# EAGLE design lm2765gizmo (EAGLE 6.6.0)
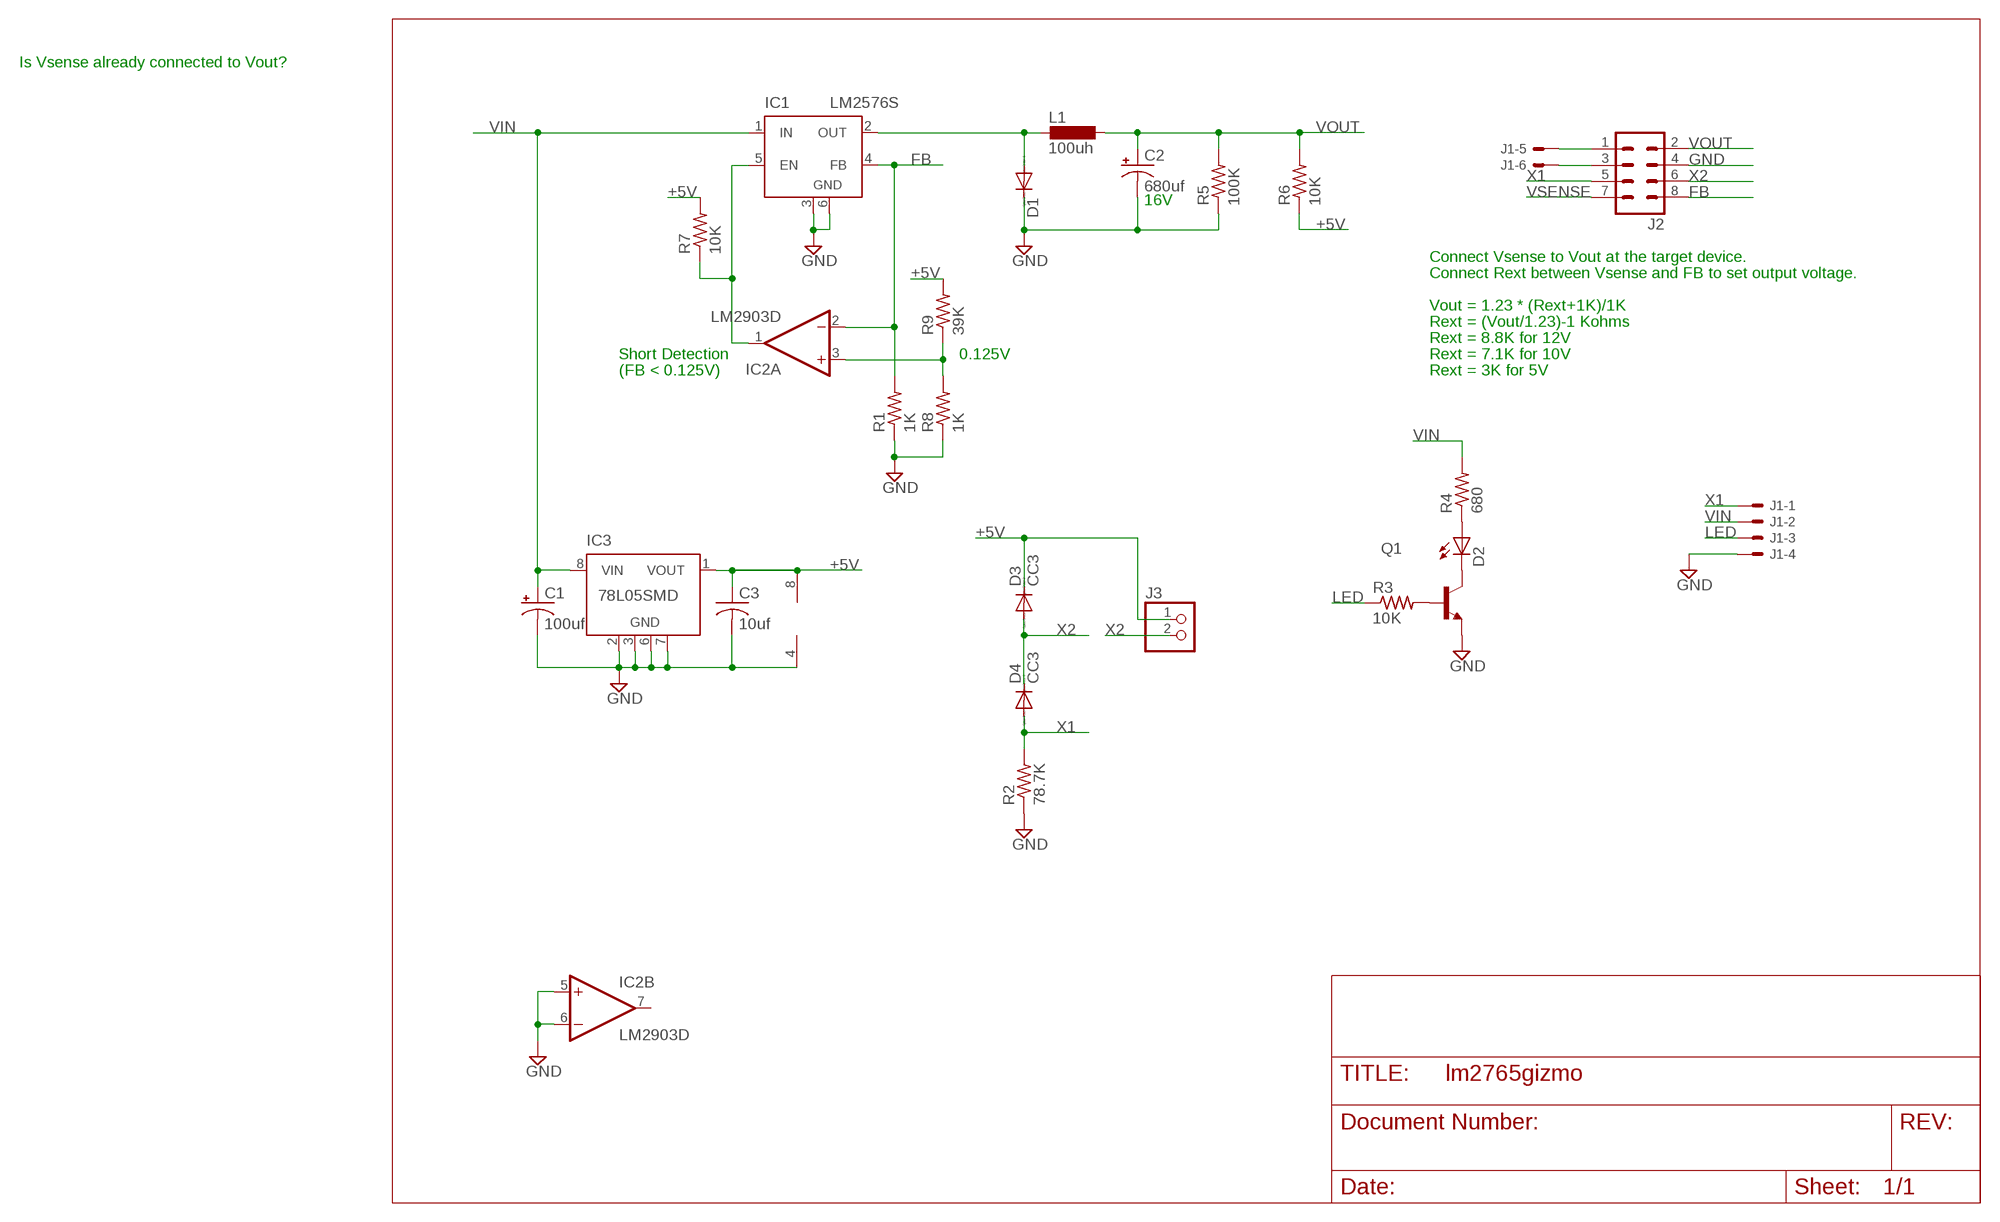
[diagram p0: schematic, sheet 1]

## Parts
C1  100uf  CPOL-US140CLH-0810  [140CLH-0810]
C2  680uf  CPOL-US140CLH-1014  [140CLH-1014]
C3  10uf  C-USC0805  [C0805]
D1  DIODE-SMC  [SMC]
D2  LEDCHIP-LED0805  [CHIP-LED0805]
D3  CC3  PMLL4150  [SOD80C]
D4  CC3  PMLL4150  [SOD80C]
IC1  LM2576S  LM2596S  [TO263-5]
IC2  LM2903D  [SO08]
IC3  78L05SMD  [SO08]
J1  53261-06  [53261-06]
J2  MA04-2  [MA04-2]
J3  PINHD-1X2  [1X02]
L1  100uh  DO3316P  [DO3316P]
Q1  BC808-NPN-SOT23-BEC  [SOT23-BEC]
R1  1K  R-US_M0805  [M0805]
R2  78.7K  R-US_M0805  [M0805]
R3  10K  R-US_M0805  [M0805]
R4  680  R-US_M0805  [M0805]
R5  100K  R-US_M0805  [M0805]
R6  10K  R-US_M0805  [M0805]
R7  10K  R-US_M0805  [M0805]
R8  1K  R-US_M0805  [M0805]
R9  39K  R-US_M0805  [M0805]

## Nets
+5V: C3.1 D3.C IC2.8(P:V+) IC3.1(VOUT) J3.1 R6.1 R7.2 R9.2
FB: IC1.4(FB) IC2.2(A:-IN) J2.8 R1.2
GND [Supply]: C1.- C2.- C3.2 D1.C IC1.3(GND) IC1.6(GND) IC2.4(P:V-) IC2.5(B:+IN) IC2.6(B:-IN) IC3.2(GND) IC3.3(GND) IC3.6(GND) IC3.7(GND) J1.4 J2.4 Q1.E R1.1 R2.1 R5.1 R8.1
LED: J1.3 R3.1
N$1: IC1.5(EN) IC2.1(A:OUT) R7.1
N$3: IC2.3(A:+IN) R8.2 R9.1
N$4: D1.A IC1.2(OUT) L1.1
N$5: D2.A R4.1
N$6: D2.C Q1.C
N$7: Q1.B R3.2
N$9: J1.5 J2.1
N$10: J1.6 J2.3
VIN [Supply]: C1.+ IC1.1(IN) IC3.8(VIN) J1.2 R4.2
VOUT [Supply]: C2.+ J2.2 L1.2 R5.2 R6.2
VSENSE: J2.7
X1: D4.A J1.1 J2.5 R2.2
X2: D3.A D4.C J2.6 J3.2
Unconnected: IC2.7(B:OUT) IC3.4(NC) IC3.5(NC)

## Notes on the sheet
- Is Vsense already connected to Vout?
- 16V
- Connect Vsense to Vout at the target device.
- Connect Rext between Vsense and FB to set output voltage.
- Vout = 1.23 * (Rext+1K)/1K
- Rext = (Vout/1.23)-1 Kohms
- Rext = 8.8K for 12V
- Short Detection | 0.125V | Rext = 7.1K for 10V
- (FB < 0.125V) | Rext = 3K for 5V

## Library data of the parts
C1 C2 = rcl:CPOL-US: POLARIZED CAPACITOR, American symbol
C3 = rcl:C-US: CAPACITOR, American symbol
D1 = diode:DIODE-: DIODE
D2 = led:LED: LED OSRAM: - CHIPLED LG R971, LG N971, LY N971, LG Q971, LY Q971, LO R971, LY R971 LH N974, LH R974 LS Q976, LO Q976, LY Q976 LO Q996 - Hyper CHIPLED LW Q18S LB Q993, LB Q99A, LB R99A - SideLED LS A670, LO A670, LY A670, LG A670, LP A670 LB A673, LV A673, LT A673, LW A673 LH A674 LY A675 LS A676, LA A676, LO A676, LY A676, LW A676 LS A679, LY A679, LG A679 - Hyper Micro SIDELED® LS Y876, LA Y876, LO Y876, LY Y876 LT Y87S - SmartLED LW L88C, LW L88S LB L89C, LB L89S, LG L890 LS L89K, LO L89K, LY L89K LS L896, LA L896, LO L896, LY L896 - TOPLED LS T670, LO T670, LY T670, LG T670, LP T670 LSG T670, LSP T670, LSY T670, LOP T670, LYG T670 LG T671, LOG T671, LSG T671 LB T673, LV T673, LT T673, LW T673 LH T674 LS T676, LA T676, LO T676, LY T676, LB T676, LH T676, LSB T676, LW T676 LB T67C, LV T67C, LT T67C, LS T67K, LO T67K, LY T67K, LW E67C LS E67B, LA E67B, LO E67B, LY E67B, LB E67C, LV E67C, LT E67C LW T67C LS T679, LY T679, LG T679 LS T770, LO T770, LY T770, LG T770, LP T770 LB T773, LV T773, LT T773, LW T773 LH T774 LS E675, LA E675, LY E675, LS T675 LS T776, LA T776, LO T776, LY T776, LB T776 LHGB T686 LT T68C, LB T68C - Hyper Mini TOPLED® LB M676 - Mini TOPLED Santana® LG M470 LS M47K, LO M47K, LY M47K Source: http://www.osram.convergy.de LUXEON: - LUMILED® LXK2-PW12-R00, LXK2-PW12-S00, LXK2-PW14-U00, LXK2-PW14-V00 LXK2-PM12-R00, LXK2-PM12-S00, LXK2-PM14-U00 LXK2-PE12-Q00, LXK2-PE12-R00, LXK2-PE12-S00, LXK2-PE14-T00, LXK2-PE14-U00 LXK2-PB12-K00, LXK2-PB12-L00, LXK2-PB12-M00, LXK2-PB14-N00, LXK2-PB14-P00, LXK2-PB14-Q00 LXK2-PR12-L00, LXK2-PR12-M00, LXK2-PR14-Q00, LXK2-PR14-R00 LXK2-PD12-Q00, LXK2-PD12-R00, LXK2-PD12-S00 LXK2-PH12-R00, LXK2-PH12-S00 LXK2-PL12-P00, LXK2-PL12-Q00, LXK2-PL12-R00 Source: www.luxeon.com KINGBRIGHT: KA-3528ASYC Source: www.kingbright.com
D3 D4 = diode:PMLL4150: DIODE high speed
IC1 = linear:LM2596S: STEP-DOWN VOLTAGE REGULATOR
IC2 = linear:LM2903: COMPARATOR
IC3 = linear:78L*SMD: Positive VOLTAGE REGULATOR
J1 = con-molex:53?-06: CONNECTOR wire to board 1.25 mm (.049 inch) pitch header; OC_FARNELL: 1125375; OC_NEWARK: unknown
J2 = con-lstb:MA04-2: PIN HEADER; OC_FARNELL: unknown; OC_NEWARK: unknown
J3 = pinhead:PINHD-1X2: PIN HEADER
L1 = inductor-coilcraft:DO3316P: COILCRAFT; OC_FARNELL: unknown; OC_NEWARK: unknown
Q1 = transistor:*-NPN-: NPN Transistror BF959 corrected 2008.03.06
R1-R9 = rcl:R-US_: RESISTOR, American symbol

## Net classes
1 Supply: width 0.762 mm, clearance 0.127 mm

## Board
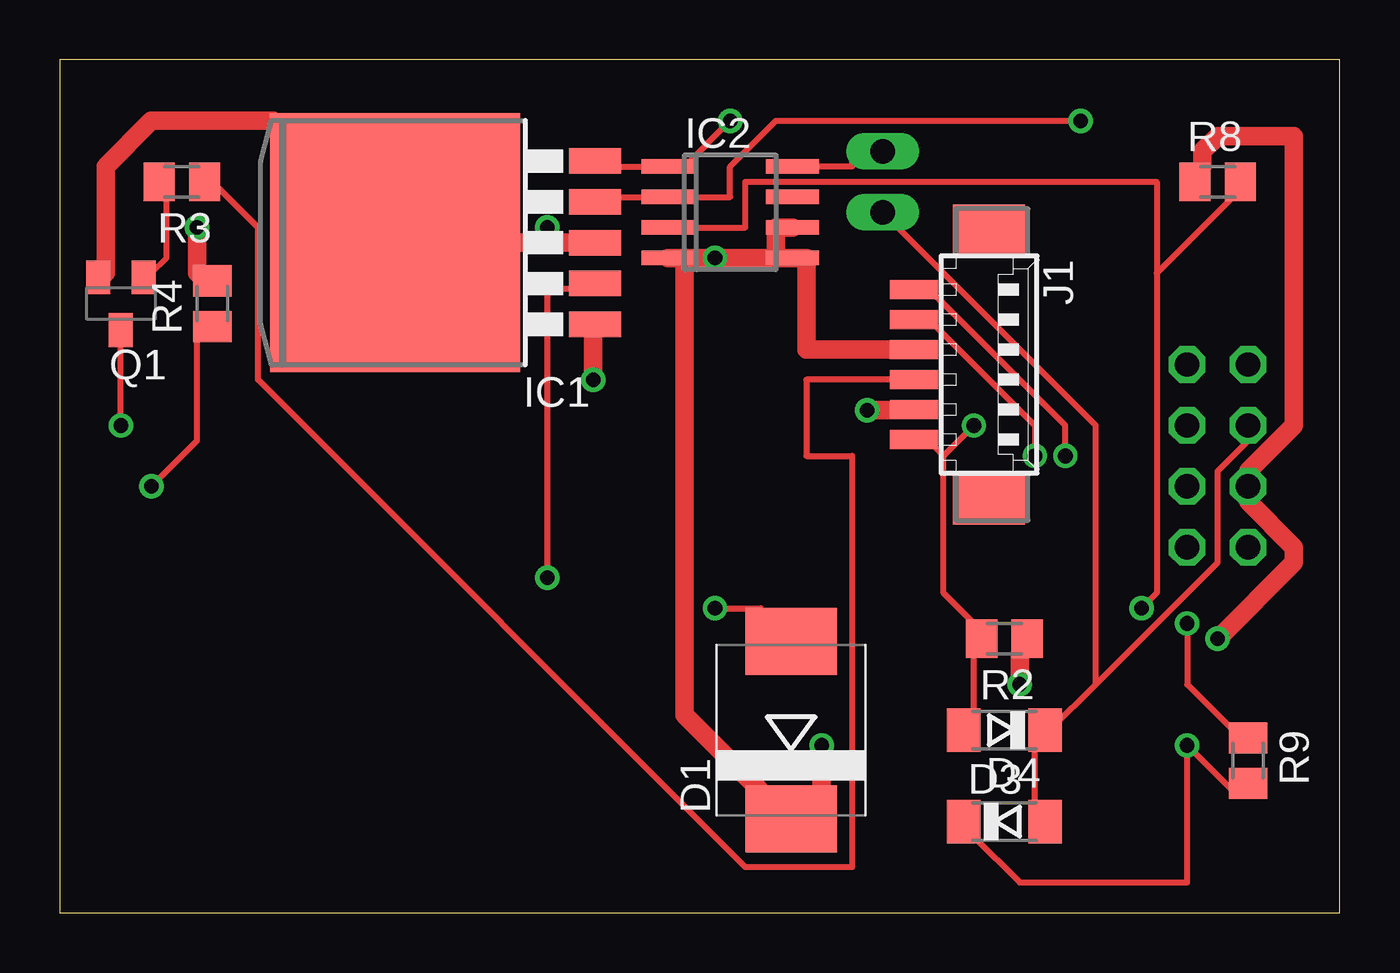
[diagram p1: board, top side]
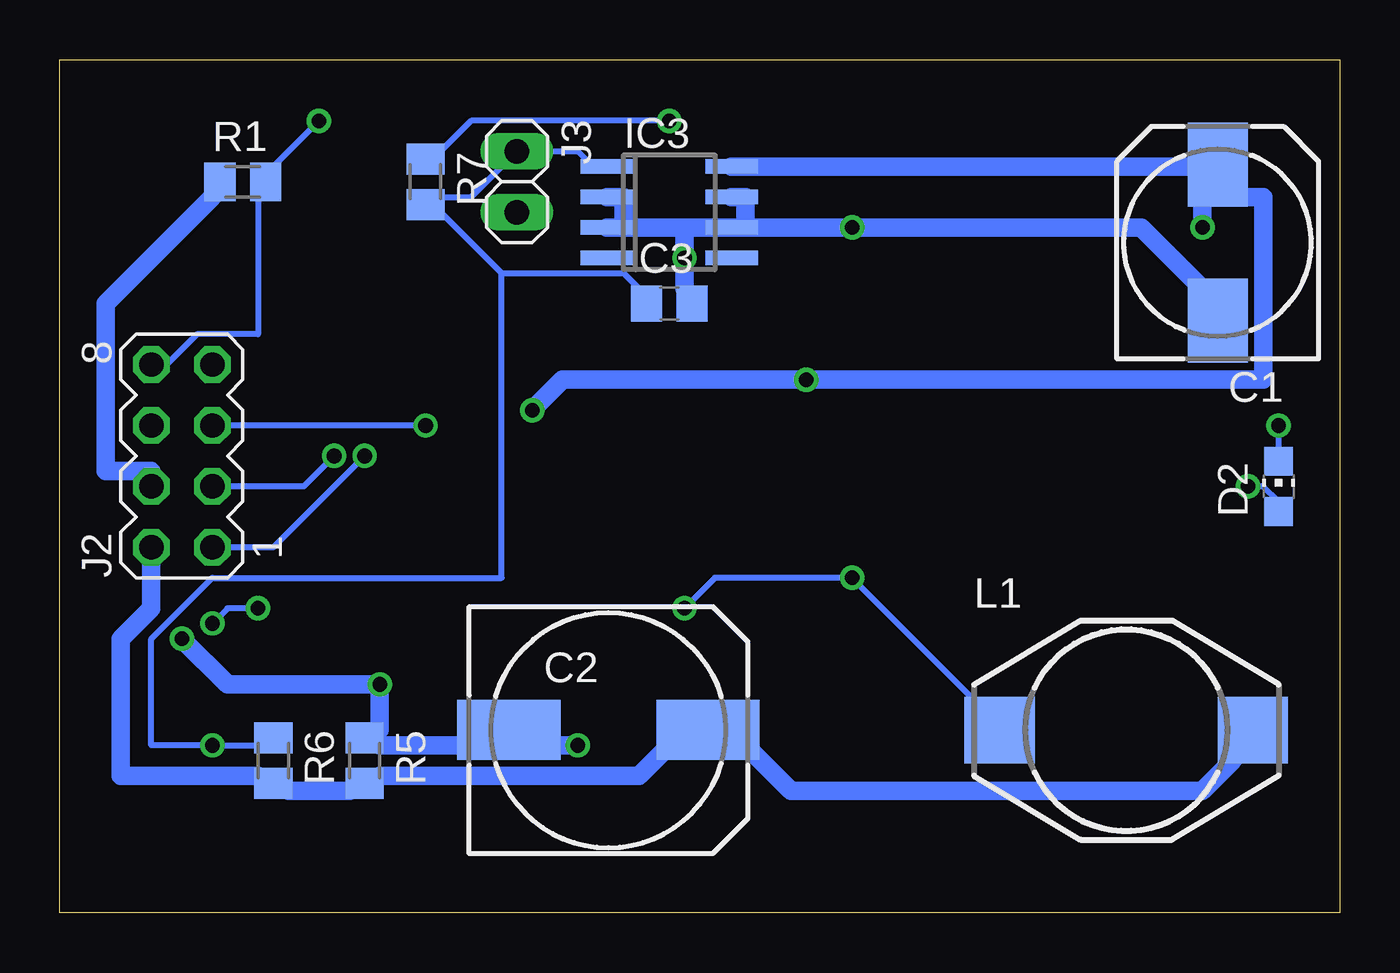
[diagram p2: board, bottom side, seen from below]

Size 53.34 x 35.56 mm. Coordinates in mm from the lower left corner, seen from the top.
Outline: 0,0 53.34,0 53.34,35.56 0,35.56 0,0
Copper layers (1*16): Top 0.035mm / dielectric 1.5mm / Bottom 0.035mm
Design rules "default": minimum track width 10mil, minimum drill 24mil, track to track 8mil, track to pad 8mil, pad to pad 8mil, via to via 8mil, smd to smd 8mil, copper to edge 40mil, drill to drill 8mil, minimum pad ring 10mil, minimum via ring 8mil, stop-mask expansion 4mil, vias tented up to drill 0mil, thermal gap 10mil

### Footprints (pad centres in the part's own frame; a part is rotated, then mirrored left to right if it is on the bottom)
140CLH-0810 = smd 3.5 x 2.5: + 3.25,0; - -3.25,0
140CLH-1014 = smd 4.3 x 2.5: + 4.15,0; - -4.15,0
C0805 = smd 1.3 x 1.5: 1 -0.95,0; 2 0.95,0
SMC = smd 2.8 x 3.8: A 3.7,0; C -3.7,0
CHIP-LED0805 = smd 1.2 x 1.2: A 0,-1.05; C 0,1.05
SOD80C = smd 1.4 x 1.8: A 1.7,0; C -1.7,0
TO263-5 = smd 1.067 x 2.159: 1 -3.404,-5.791; 2 -1.702,-5.791; 3 0,-5.791; 4 1.702,-5.791; 5 3.404,-5.791 | smd 10.8 x 10.41: 6 0,2.54
SO08 = smd 0.6 x 2.2: 1 -1.905,-2.6; 2 -0.635,-2.6; 3 0.635,-2.6; 4 1.905,-2.6; 5 1.905,2.6; 6 0.635,2.6; 7 -0.635,2.6; 8 -1.905,2.6
53261-06 = smd 0.8 x 2: 1 3.125,-2.5; 2 1.875,-2.5; 3 0.625,-2.5; 4 -0.625,-2.5; 5 -1.875,-2.5; 6 -3.125,-2.5 | smd 2.1 x 3: S1 5.625,0.625; S2 -5.625,0.625
MA04-2 = drill 1.016 octagon: 1 -3.81,-1.27; 2 -3.81,1.27; 3 -1.27,-1.27; 4 -1.27,1.27; 5 1.27,-1.27; 6 1.27,1.27; 7 3.81,-1.27; 8 3.81,1.27
1X02 = drill 1.016 long: 1 -1.27,0; 2 1.27,0
DO3316P = smd 2.92 x 2.79: 1 -5.28,0; 2 5.28,0
SOT23-BEC = smd 1 x 1.4: B -0.95,-1.1; C 0,1.1; E 0.95,-1.1
M0805 = smd 1.3 x 1.6: 1 -0.95,0; 2 0.95,0

### Placement (x,y rotation side)
C1  5.08,27.94 90 bottom
C2  30.48,7.62 0 bottom
C3  27.94,25.4 0 bottom
D1  30.48,7.62 90 top
D2  2.54,17.78 0 bottom
D3  39.37,3.81 0 top
D4  39.37,7.62 180 top
IC1  16.51,27.94 90 top
IC2  27.94,29.21 270 top
IC3  27.94,29.21 270 bottom
J1  38.1,22.86 270 top
J2  48.26,19.05 90 bottom
J3  34.29,30.48 270 bottom
L1  8.89,7.62 0 bottom
Q1  2.54,25.4 180 top
R1  45.72,30.48 0 bottom
R2  39.37,11.43 180 top
R3  5.08,30.48 180 top
R4  6.35,25.4 90 top
R5  40.64,6.35 270 bottom
R6  44.45,6.35 270 bottom
R7  38.1,30.48 270 bottom
R8  48.26,30.48 0 top
R9  49.53,6.35 270 top

### Tracks (layer width: path | path; a pad name or v marks a point on that pad's centre or on a via)
+5V  (via drill 0.61)
  Top 0.254: IC2.8 33.02,31.11 33.02,31.75 J3.1 | R9.2 48.9,5.08 v46.99,6.99 46.99,1.27 40.01,1.27 38.1,3.17 D3.C
  Bottom 0.254: IC2.8 31.11,31.11 31.75,31.75 J3.1 36.2,29.84 37.47,29.84 R7.2 37.47,29.21 34.92,26.67 | 34.92,26.67 29.84,26.67 29.21,26.04 C3.1 | R6.1 45.09,6.99 v46.99,6.99 49.53,6.99 49.53,11.43 46.99,13.97 34.92,13.97 34.92,26.67
FB  (via drill 0.61)
  Top 0.254: IC1.4 22.86,29.84 IC2.2 27.94,29.84 27.94,31.11 29.84,33.02 v42.55,33.02
  Bottom 0.254: J2.8 48.9,22.86 47.62,24.13 45.09,24.13 45.09,29.84 R1.2 44.45,31.11 v42.55,33.02
GND  (via drill 0.61)
  Top 0.762: Q1.E 1.91,26.67 1.91,31.11 3.81,33.02 8.89,33.02 IC1.6 20.32,27.94 | 20.32,27.94 IC1.3 | R8.1 47.62,31.11 47.62,31.75 48.26,32.38 51.44,32.38 51.44,20.32 49.53,18.41 J2.4 49.53,17.14 51.44,15.24 51.44,14.61 v48.26,11.43 | v40.01,9.53 40.01,10.79 R2.1 | 29.84,27.3 v27.3,27.3 26.04,27.3 | 29.84,27.3 29.84,28.57 IC2.6 | 29.84,27.3 IC2.5 31.11,27.3 31.11,23.5 35.56,23.5 J1.4 | 26.04,27.3 26.04,8.26 29.21,5.08 D1.C 31.75,5.08 v31.75,6.99 | 26.04,27.3 IC2.4 | 20.32,27.94 v20.32,28.57
  Bottom 0.762: 29.84,28.57 29.84,29.84 IC3.2 | 27.3,28.57 v27.3,27.3 27.3,26.04 C3.2 | 27.3,28.57 IC3.6 24.77,28.57 | 24.77,28.57 24.77,29.84 IC3.7 | 27.3,28.57 29.84,28.57 | 29.84,28.57 IC2.6 | 24.77,28.57 v20.32,28.57 8.26,28.57 5.71,26.04 C1.- | R1.1 46.99,29.84 51.44,25.4 51.44,18.41 49.53,18.41 J2.4 | v31.75,6.99 33.02,6.99 C2.- 36.2,6.99 40.01,6.99 R5.1 40.01,7.62 v40.01,9.53 46.35,9.53 v48.26,11.43
LED
  Top 0.254: R3.1 6.35,30.48 8.26,28.57 8.26,22.23 28.57,1.91 33.02,1.91 33.02,19.05 31.11,19.05 31.11,22.23 35.56,22.23 J1.3
N$1  (via drill 0.61)
  Top 0.254: v27.94,33.02 26.04,31.11 IC2.1 22.86,31.11 IC1.5
  Bottom 0.254: v27.94,33.02 36.2,33.02 37.47,31.75 R7.1
N$3  (via drill 0.61)
  Top 0.254: v46.99,12.06 46.99,9.53 48.9,7.62 R9.1 | v45.09,12.7 45.72,13.34 45.72,26.67 | 45.72,26.67 48.9,29.84 R8.2 | 45.72,26.67 45.72,30.48 28.57,30.48 28.57,28.57 IC2.3
  Bottom 0.254: v46.99,12.06 46.35,12.7 v45.09,12.7
N$4  (via drill 0.61)
  Top 0.254: v20.32,13.97 20.32,26.04 21.59,26.04 IC1.2 | v27.3,12.7 29.21,12.7 D1.A
  Bottom 0.254: L1.1 15.24,8.89 v20.32,13.97 26.04,13.97 v27.3,12.7
N$5  (via drill 0.61)
  Top 0.254: v3.81,17.78 5.71,19.68 5.71,24.13 R4.1
  Bottom 0.254: v3.81,17.78 3.17,17.78 2.54,17.14 D2.A
N$6  (via drill 0.61)
  Top 0.254: v2.54,20.32 Q1.C
  Bottom 0.254: D2.C v2.54,20.32
N$7
  Top 0.254: Q1.B 3.81,26.67 4.45,27.3 4.45,29.84 R3.2
N$9  (via drill 0.61)
  Top 0.254: v40.64,19.05 40.64,20.32 36.2,24.77 J1.5
  Bottom 0.254: v40.64,19.05 44.45,15.24 J2.1
N$10  (via drill 0.61)
  Top 0.254: v41.91,19.05 41.91,20.32 36.2,26.04 J1.6
  Bottom 0.254: v41.91,19.05 43.18,17.78 J2.3
VIN  (via drill 0.61)
  Top 0.762: v5.71,28.57 5.71,26.67 R4.2 | v33.66,20.95 35.56,20.95 J1.2 | v22.23,22.23 22.23,24.13 IC1.1
  Bottom 0.762: v5.71,28.57 5.71,29.84 C1.+ | v33.66,20.95 32.38,22.23 v22.23,22.23 3.17,22.23 3.17,29.84 4.45,29.84 C1.+ | IC3.8 5.71,31.11 C1.+
VOUT
  Bottom 0.762: L1.2 4.45,6.35 5.71,5.08 22.86,5.08 24.77,6.99 C2.+ 27.94,6.99 29.21,5.71 40.01,5.71 R5.2 41.27,5.08 43.81,5.08 R6.2 45.09,5.71 50.8,5.71 50.8,11.43 49.53,12.7 J2.2
X1  (via drill 0.61)
  Top 0.254: D4.A 38.1,8.26 38.1,10.79 R2.2 38.1,12.06 36.83,13.34 36.83,19.05 | 36.83,19.05 36.2,19.68 J1.1 | 36.83,19.05 v38.1,20.32
  Bottom 0.254: v38.1,20.32 J2.5
X2
  Top 0.254: D3.A 40.64,4.45 40.64,6.99 D4.C 41.27,7.62 43.18,9.53 | 43.18,9.53 48.26,14.61 48.26,18.41 49.53,19.68 J2.6 | 43.18,9.53 43.18,20.32 J3.2